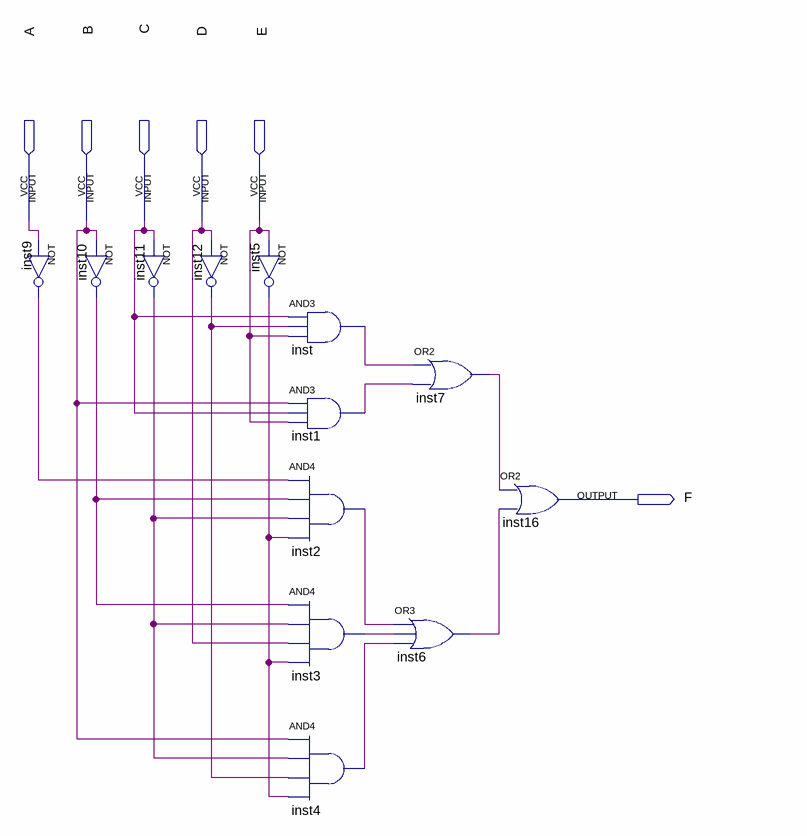
[diagram p0: schematic sheet]
// Quartus schematic lab2.bdf as structural Verilog: 13 symbols, 6 pins
module lab2 (
  input  A,
  input  B,
  input  C,
  input  D,
  input  E,
  output F
);

  wire inst1_out, inst2_out, inst3_out, inst4_out, inst5_out, inst6_out, inst7_out, inst9_out, inst10_out,
       inst11_out, inst12_out, inst_out;

  not inst9 (inst9_out, A);
  not inst10 (inst10_out, B);
  not inst11 (inst11_out, C);
  not inst5 (inst5_out, E);
  not inst12 (inst12_out, D);
  and inst (inst_out, C, inst12_out, E);
  and inst1 (inst1_out, B, C, E);
  and inst2 (inst2_out, inst9_out, inst10_out, inst11_out, inst5_out);
  and inst3 (inst3_out, inst10_out, inst11_out, D, inst5_out);
  and inst4 (inst4_out, B, inst11_out, inst12_out, inst5_out);
  or inst6 (inst6_out, inst2_out, inst3_out, inst4_out);
  or inst7 (inst7_out, inst_out, inst1_out);
  or inst16 (F, inst7_out, inst6_out);
endmodule
